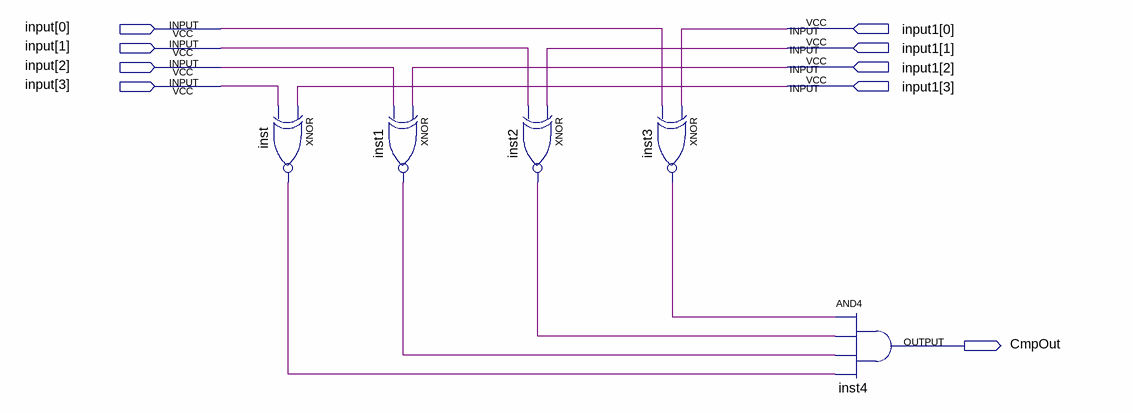
[diagram p0: schematic sheet]
// Quartus schematic EqCmp4.bdf as structural Verilog: 5 symbols, 9 pins
module EqCmp4 (
  input  [3:0] \input ,
  input  [3:0] input1,
  output CmpOut
);

  wire inst1_out, inst2_out, inst3_out, inst_out;

  xnor inst (inst_out, input1[3], \input [3]);
  xnor inst1 (inst1_out, input1[2], \input [2]);
  xnor inst2 (inst2_out, input1[1], \input [1]);
  xnor inst3 (inst3_out, input1[0], \input [0]);
  // AND4 inst4 has open pins: IN1=inst3_out, IN2=inst2_out, IN3=inst1_out, IN4=inst_out, OUT=open
endmodule
